# Altium schematic sheet STM32F407 CONTROLLER.SchDoc: MCU
size A4; ENG_APP_DATE: --/--/--; DSN_APP_DATE: --/--/--; CHK_APP_DATE: --/--/--; Date: *******; ApprovedBy: *******; CheckedBy: None; Author: *******; CompanyName: *******; DrawnBy: Name; Engineer: *******; Organization: *******; Address1: *******; Address2: *******; Address3: *******; Address4: *******; DocumentNumber: 3; Revision: *******; SheetNumber: 3; SheetTotal: 11; CurrentTime: *******; CurrentDate: *******; Time: *******; DocumentFullPathAndName: *******; DocumentName: *******; ModifiedDate: *******; ImagePath: *******; ProjectName: *******; Application_BuildNumber: *******
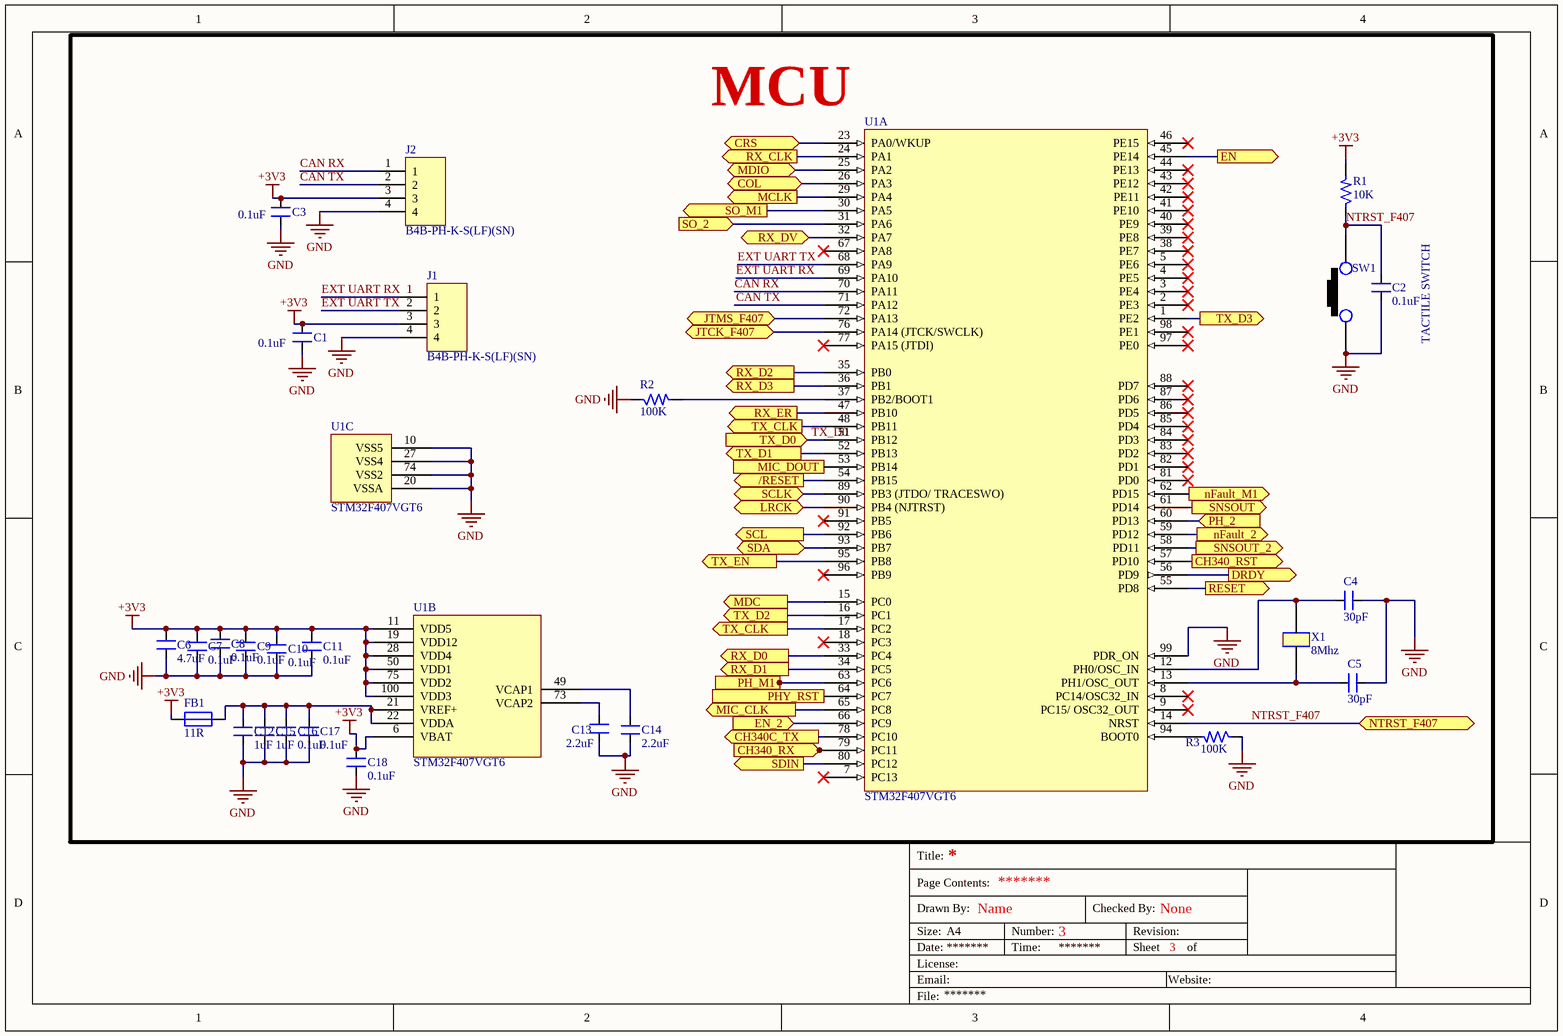
[diagram p0: STM32F407 CONTROLLER.SchDoc]

## Parts
C1  0.1uF  [CAP_0805]
C2  0.1uF  [CAP_0805]
C3  0.1uF  [CAP_0805]
C4  30pF  [CAP_0805]
C5  30pF  [CAP_0805]
C6  4.7uF  [CAP_0805]
C7  0.1uF  [CAP_0805]
C8  0.1uF  [CAP_0805]
C9  0.1uF  [CAP_0805]
C10  0.1uF  [CAP_0805]
C11  0.1uF  [CAP_0805]
C12  1uF  [CAP_0805]
C13  2.2uF  [CAP_0805]
C14  2.2uF  [CAP_0805]
C15  1uF  [CAP_0805]
C16  0.1uF  [CAP_0805]
C17  0.1uF  [CAP_0805]
C18  0.1uF  [CAP_0805]
FB1  11R  [IND_0805]
J1  B4B-PH-K-S(LF)(SN)  [CON4_78_B4B-PH-K-S(LF)(SN)]
J2  B4B-PH-K-S(LF)(SN)  [CON4_78_B4B-PH-K-S(LF)(SN)]
R1  10K  [RES_0805]
R2  100K  [RES_0805]
R3  100K  [RES_0805]
SW1  TACTILE SWITCH  [SW_342_SMD]
U1  STM32F407VGT6  [QFN100_19.6_669_58X10_SMD]  (parts A,B,C of 3)
X1  8Mhz  [XTAL_314_240X47_SMD]

## Ports
/RESET (out), CH340_RST (out), CH340_RX (in), CH340C_TX (out), COL (bidir), CRS (bidir), DRDY (out), EN (out), EN_2 (in), JTCK_F407 (bidir), JTMS_F407 (bidir), LRCK (bidir), MCLK (out), MDC (out), MDIO (bidir), MIC_CLK (out), MIC_DOUT (out), nFault_2 (out), nFault_M1 (out), NTRST_F407 (bidir), PH_2 (in), PH_M1 (out), PHY_RST (out), RESET (out), RX_CLK (out), RX_D0 (out), RX_D1 (out), RX_D2 (out), RX_D3 (out), RX_DV (bidir), RX_ER (out), SCL (out), SCLK (bidir), SDA (bidir), SDIN (out), SNSOUT (out), SNSOUT_2 (out), SO_2 (in), SO_M1 (out), TX_CLK (out), TX_D0 (in), TX_D1 (out), TX_D2 (out), TX_D3 (out), TX_EN (out)

## Nets
+3V3: C1.2 C3.2 C6.2 C7.2 C8.2 C9.2 C10.2 C11.2 C18.2 FB1.1 J1.3 J2.3 R1.2 U1.6(VBAT) U1.11(VDD5) U1.19(VDD12) U1.28(VDD4) U1.50(VDD1) U1.75(VDD2) U1.100(VDD3)
GND: C1.1 C2.1 C3.1 C4.2 C5.2 C6.1 C7.1 C8.1 C9.1 C10.1 C11.1 C12.1 C13.1 C14.1 C15.1 C16.1 C17.1 C18.1 J1.4 J2.4 R2.1 R3.1 SW1.1 U1.10(VSS5) U1.20(VSSA) U1.27(VSS4) U1.74(VSS2) U1.99(PDR_ON)
/RESET: U1.54(PB15) ; port /RESET
CAN RX: J2.1 U1.70(PA11)
CAN TX: J2.2 U1.71(PA12)
CH340_RST: U1.57(PD10) ; port CH340_RST
CH340_RX: U1.79(PC11) ; port CH340_RX
CH340C_TX: U1.78(PC10) ; port CH340C_TX
COL: U1.26(PA3) ; port COL
CRS: U1.23(PA0/WKUP) ; port CRS
DRDY: U1.56(PD9) ; port DRDY
EN: U1.45(PE14) ; port EN
EN_2: U1.66(PC9) ; port EN_2
EXT UART RX: J1.1 U1.69(PA10)
EXT UART TX: J1.2 U1.68(PA9)
JTCK_F407: U1.76(PA14_(JTCK/SWCLK)) ; port JTCK_F407
JTMS_F407: U1.72(PA13) ; port JTMS_F407
LRCK: U1.90(PB4_(NJTRST)) ; port LRCK
MCLK: U1.29(PA4) ; port MCLK
MDC: U1.15(PC0) ; port MDC
MDIO: U1.25(PA2) ; port MDIO
MIC_CLK: U1.65(PC8) ; port MIC_CLK
MIC_DOUT: U1.53(PB14) ; port MIC_DOUT
nFault_2: U1.59(PD12) ; port nFault_2
nFault_M1: U1.62(PD15) ; port nFault_M1
NTRST_F407: C2.2 R1.1 SW1.2 U1.14(NRST) ; port NTRST_F407
PH_2: U1.60(PD13) ; port PH_2
PH_M1: U1.63(PC6) ; port PH_M1
PHY_RST: U1.64(PC7) ; port PHY_RST
RESET: U1.55(PD8) ; port RESET
RX_CLK: U1.24(PA1) ; port RX_CLK
RX_D0: U1.33(PC4) ; port RX_D0
RX_D1: U1.34(PC5) ; port RX_D1
RX_D2: U1.35(PB0) ; port RX_D2
RX_D3: U1.36(PB1) ; port RX_D3
RX_DV: U1.32(PA7) ; port RX_DV
RX_ER: U1.47(PB10) ; port RX_ER
SCL: U1.92(PB6) ; port SCL
SCLK: U1.89(PB3_(JTDO/_TRACESWO)) ; port SCLK
SDA: U1.93(PB7) ; port SDA
SDIN: U1.80(PC12) ; port SDIN
SNSOUT: U1.61(PD14) ; port SNSOUT
SNSOUT_2: U1.58(PD11) ; port SNSOUT_2
SO_2: U1.31(PA6) ; port SO_2
SO_M1: U1.30(PA5) ; port SO_M1
TX_CLK: U1.17(PC2) U1.48(PB11) ; port TX_CLK
TX_D0: U1.51(PB12) ; port TX_D0
TX_D1: U1.52(PB13) ; port TX_D1
TX_D2: U1.16(PC1) ; port TX_D2
TX_D3: U1.1(PE2) ; port TX_D3
TX_EN: U1.95(PB8) ; port TX_EN
NetC4_1: C4.1 U1.12(PH0/OSC_IN) X1.2
NetC5_1: C5.1 U1.13(PH1/OSC_OUT) X1.1
NetC12_2: C12.2 C15.2 C16.2 C17.2 FB1.2 U1.21(VREF+) U1.22(VDDA)
NetC13_2: C13.2 U1.73(VCAP2)
NetC14_2: C14.2 U1.49(VCAP1)
NetR2_2: R2.2 U1.37(PB2/BOOT1)
NetR3_2: R3.2 U1.94(BOOT0)

Not connected (* = marked no-connect by the designer): U1 2(PE3)* 3(PE4)* 4(PE5)* 5(PE6)* 7(PC13)* 8(PC14/OSC32_IN)* 9(PC15/_OSC32_OUT)* 18(PC3)* 38(PE7)* 39(PE8)* 40(PE9)* 41(PE10)* 42(PE11)* 43(PE12)* 44(PE13)* 46(PE15)* 67(PA8)* 77(PA15_(JTDI))* 81(PD0)* 82(PD1)* 83(PD2)* 84(PD3)* 85(PD4)* 86(PD5)* 87(PD6)* 88(PD7)* 91(PB5)* 96(PB9)* 97(PE0)* 98(PE1)*

## Notes on the sheet
- Title:
- Drawn By:
- Page Contents:
- Checked By:
- Size:
- Date:
- File:
- License:
- Email:
- A4
- Number:
- Time:
- Revision:
- Sheet
- Website:
- of

## Library data of the parts
C1-C3 = CAP_0.1uF-50V-5%-0805: 0.1µF ±5% 50V Ceramic Capacitor X7R 0805 (2012 Metric); Manufacturer: AVX Corporation; Manufacturer Part Number: 08055C104JAT4A; Alternate Part Number-1: 0805B104M500; Case/Package: 0805; Supplier-1: SIRICOM; Supplier Part Number-1: 0805B104J500CT
C4 C5 = CAP_30pF-50V-10%-0805: ±10% 50V Ceramic Capacitor C0G, NP0 0805 (2012 Metric); Manufacturer Part Number: C0805C300K5GAC7800; Manufacturer: KEMET; Alternate Part Number: NA; Case/Package: 0805; Supplier-1: Digikey; Supplier Part Number-1: 399-17443-1-ND - Cut Tape (CT)
C6 = CAP_4.7uF-50V-10%-0805: 4.7µF ±10% 50V Ceramic Capacitor X5R 0805 (2012 Metric); Manufacturer: Yageo; Manufacturer Part Number: GRM21BR61H475KE51L; Alternate Part Number-1: NA; Case/Package: 0805; Supplier-1: SIRICOM; Supplier Part Number-1: CL21A475KBQNNNE
C7-C11 C16-C18 = CAP_0.1uF-50V-10%-0805: 0.1µF ±10% 50V Ceramic Capacitor X7R 0805 (2012 Metric); Manufacturer: Samsung; Manufacturer Part Number: CL21B104KBCNNNC; Alternate Part Number-1: NA; Case/Package: 0805; Supplier-1: SIRICOM; Supplier Part Number-1: 0805B104K500CT
C12 C15 = CAP_1uF-50V-5%-0805: 1µF ±5% 50V Ceramic Capacitor X7R 0805 (2012 Metric); Manufacturer: Samsung; Manufacturer Part Number: CC0805JKX7R9BB105; Alternate Part Number-1: 0805F105M500NT; Case/Package: 0805; Supplier-1: SIRICOM; Supplier Part Number-1: CL21B105KBFNNNE
C13 C14 = CAP_2.2uF-25V-10%-0805: 2.2µF ±10% 25V Ceramic Capacitor X7R 0805 (2012 Metric); Manufacturer: KEMET; Manufacturer Part Number: CL21B225KAFNFNE; Alternate Part Number-1: NA; Case/Package: 0805; Supplier-1: SIRICOM; Supplier Part Number-1: CL21A225KAFNNNE
FB1 = FB_11R-100MHZ-1.5A-0805: 11 Ohms @ 100MHz 1 Power Line Ferrite Bead 0805 (2012 Metric) 1.5A 60mOhm; Manufacturer: Murata; Manufacturer Part Number: MI0805K110R-10; Alternate Part Number-1: NA; Case/Package: 0805; Supplier-1: SIRICOM; Supplier Part Number-1: ACMS201209A110
J1 J2 = CON-PLG_4X1-78-ST-TH: Connector Header Through Hole 4 position 0.079" (2.00mm); Manufacturer: JST; Mating Part Number: PHR-4; Crimp Part Number: ASPHSPH24K51; Alternate Part Number-1: NA; Manufacturer Part Number: B4B-PH-K-S(LF)(SN); Case/Package: TH; Supplier-1: SP Road; Supplier Part Number-1: NA
R1 = RES_10K-0.125W-1%-0805: 10 kOhms ±1% 0.125W, 1/8W Chip Resistor 0805 (2012 Metric) Automotive AEC-Q200 Thick Film; Manufacturer: CTS; Manufacturer Part Number: WR08X1002FTL; Case/Package: 0805; Supplier-1: SIRICOM; Supplier Part Number-1: WR08X1002FTL; Alternate Part Number-1: WR08X1002FTL
R2 R3 = RES_100K-0.125W-1%-0805: 100 kOhms ±1% 0.125W, 1/8W Chip Resistor 0805 (2012 Metric) Automotive AEC-Q200 Thick Film; Manufacturer: Walsin; Manufacturer Part Number: WR08X1003FTL; Alternate Part Number-1: NA; Case/Package: 0805; Supplier-1: SIRICOM; Supplier Part Number-1: WR08X1003FTL
SW1 = SW1_RS-282G05A3-SMRT-SMD: Tactile Switch SPST-NO Top Actuated Surface Mount; Manufacturer: ITT C&K; Alternate Part Number-1: NA; Manufacturer Part Number: RS-282G05A3-SMRT; Case/Package: SMD; Supplier-1: SP ROAD; Supplier Part Number-1: RS-282G05A3-SMRT
U1 = IC_STM32F407VGT6: ARM® Cortex®-M4 STM32F4 Microcontroller IC 32-Bit 168MHz 1MB (1M x 8) FLASH 100-LQFP (14x14); Manufacturer: STMicroelectronics; Alternate Part Number-1: STM32F407VET6; Manufacturer Part Number: STM32F407VGT6; Case/Package: LQFP100; Supplier-1: ARROW; Supplier Part Number-1: STM32F407VGT6
X1 = XTAL_8MHZ-ECS-80-32-5PX-SMD: 8MHz ±30ppm Crystal 32pF 60 Ohms HC-49/US; Manufacturer: Fox Electronics; Manufacturer Part Number: ECS-80-32-5PX-TR; Alternate Part Number-1: NA; Case/Package: SMD/SMT; Supplier-1: SP ROAD; Supplier Part Number-1: ECS-80-32-5PX-TR